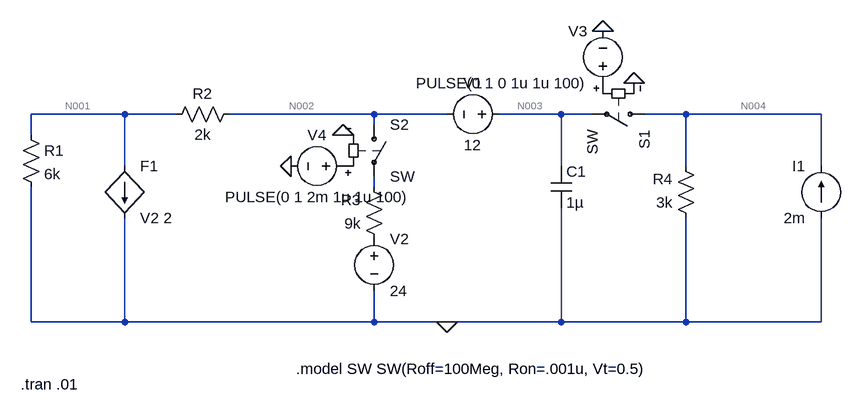
[diagram p0: schematic PSS6.asc]
PSS6.asc, the LTspice schematic file:
Version 4.1
SHEET 1 880 680
WIRE -576 96 -720 96
WIRE -496 96 -576 96
WIRE -192 96 -416 96
WIRE -80 96 -192 96
WIRE 96 96 0 96
WIRE 144 96 96 96
WIRE 288 96 224 96
WIRE 496 96 288 96
WIRE -192 112 -192 96
WIRE -720 128 -720 96
WIRE -576 176 -576 96
WIRE 96 176 96 96
WIRE 288 176 288 96
WIRE 496 176 496 96
WIRE -192 208 -192 192
WIRE -720 416 -720 208
WIRE -576 416 -576 256
WIRE -576 416 -720 416
WIRE -192 416 -192 368
WIRE -192 416 -576 416
WIRE -80 416 -192 416
WIRE 96 416 96 240
WIRE 96 416 -80 416
WIRE 288 416 288 256
WIRE 288 416 96 416
WIRE 496 416 496 256
WIRE 496 416 288 416
FLAG -80 416 0
FLAG -240 128 0
FLAG 208 48 0
FLAG -320 176 0
FLAG 160 -32 0
SYMBOL res -736 112 R0
SYMATTR InstName R1
SYMATTR Value 6k
SYMBOL res -400 80 R90
WINDOW 0 0 56 VBottom 2
WINDOW 3 32 56 VTop 2
SYMATTR InstName R2
SYMATTR Value 2k
SYMBOL res -176 304 R180
WINDOW 0 36 76 Left 2
WINDOW 3 36 40 Left 2
SYMATTR InstName R3
SYMATTR Value 9k
SYMBOL res 304 272 R180
WINDOW 0 36 76 Left 2
WINDOW 3 36 40 Left 2
SYMATTR InstName R4
SYMATTR Value 3k
SYMBOL cap 80 176 R0
SYMATTR InstName C1
SYMATTR Value 1µ
SYMATTR SpiceLine Rser=0
SYMBOL voltage 16 96 R90
WINDOW 0 -32 56 VBottom 2
WINDOW 3 32 56 VTop 2
SYMATTR InstName V1
SYMATTR Value 12
SYMBOL current 496 256 R180
WINDOW 0 24 80 Left 2
WINDOW 3 24 0 Left 2
SYMATTR InstName I1
SYMATTR Value 2m
SYMBOL voltage -192 272 R0
SYMATTR InstName V2
SYMATTR Value 24
SYMBOL f -576 176 R0
SYMATTR InstName F1
SYMATTR Value V2 2
SYMBOL sw 240 96 R90
SYMATTR InstName S1
SYMBOL sw -192 96 R0
SYMATTR InstName S2
SYMBOL voltage 160 64 R180
WINDOW 0 24 96 Left 2
WINDOW 3 24 16 Left 2
WINDOW 123 0 0 Left 0
WINDOW 39 0 0 Left 0
SYMATTR InstName V3
SYMATTR Value PULSE(0 1 0 1u 1u 100)
SYMBOL voltage -224 176 R90
WINDOW 0 -32 56 VBottom 2
WINDOW 3 32 56 VTop 2
WINDOW 123 0 0 Left 0
WINDOW 39 0 0 Left 0
SYMATTR InstName V4
SYMATTR Value PULSE(0 1 2m 1u 1u 100)
TEXT -312 488 Left 2 !.model SW SW(Roff=100Meg, Ron=.001u, Vt=0.5)
TEXT -736 512 Left 2 !.tran .01

The netlist it stands for:
* PSS6.asc
R1 N001 0 6k
R2 N002 N001 2k
R3 P001 N005 9k
R4 0 N004 3k
C1 N003 0 1µ Rser=0
V1 N003 N002 12
I1 0 N004 2m
V2 P001 0 24
F1 N001 0 V2 2
S1 N004 N003 P002 0 SW
S2 N002 N005 P003 0 SW
V3 P002 0 PULSE(0 1 0 1u 1u 100)
V4 P003 0 PULSE(0 1 2m 1u 1u 100)
.model SW SW(Roff=100Meg, Ron=.001u, Vt=0.5)
.tran .01
.backanno
.end

* Results of the author's LTspice run, read from the files saved beside the schematic
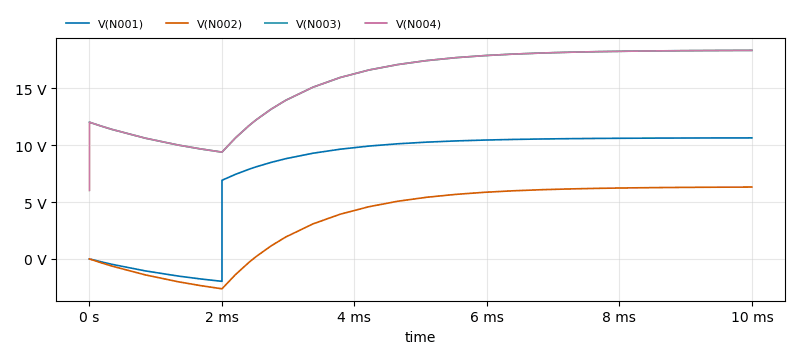
[diagram p1: Transient Analysis of PSS6.asc, plotted from the saved traces]
* Transient Analysis, 1 run:
*   V(N001): min -1.962 V, max 10.63 V, average 7.78 V, rms 9.002 V, last 10.63 V
*   V(N002): min -2.617 V, max 6.313 V, average 3.552 V, rms 4.772 V, last 6.313 V
*   V(N003): min 9.383 V, max 18.31 V, average 15.55 V, rms 15.87 V, last 18.31 V
*   V(N004): min 6 V, max 18.31 V, average 15.55 V, rms 15.87 V, last 18.31 V